# EAGLE design FreqRef (EAGLE 7.4.0)
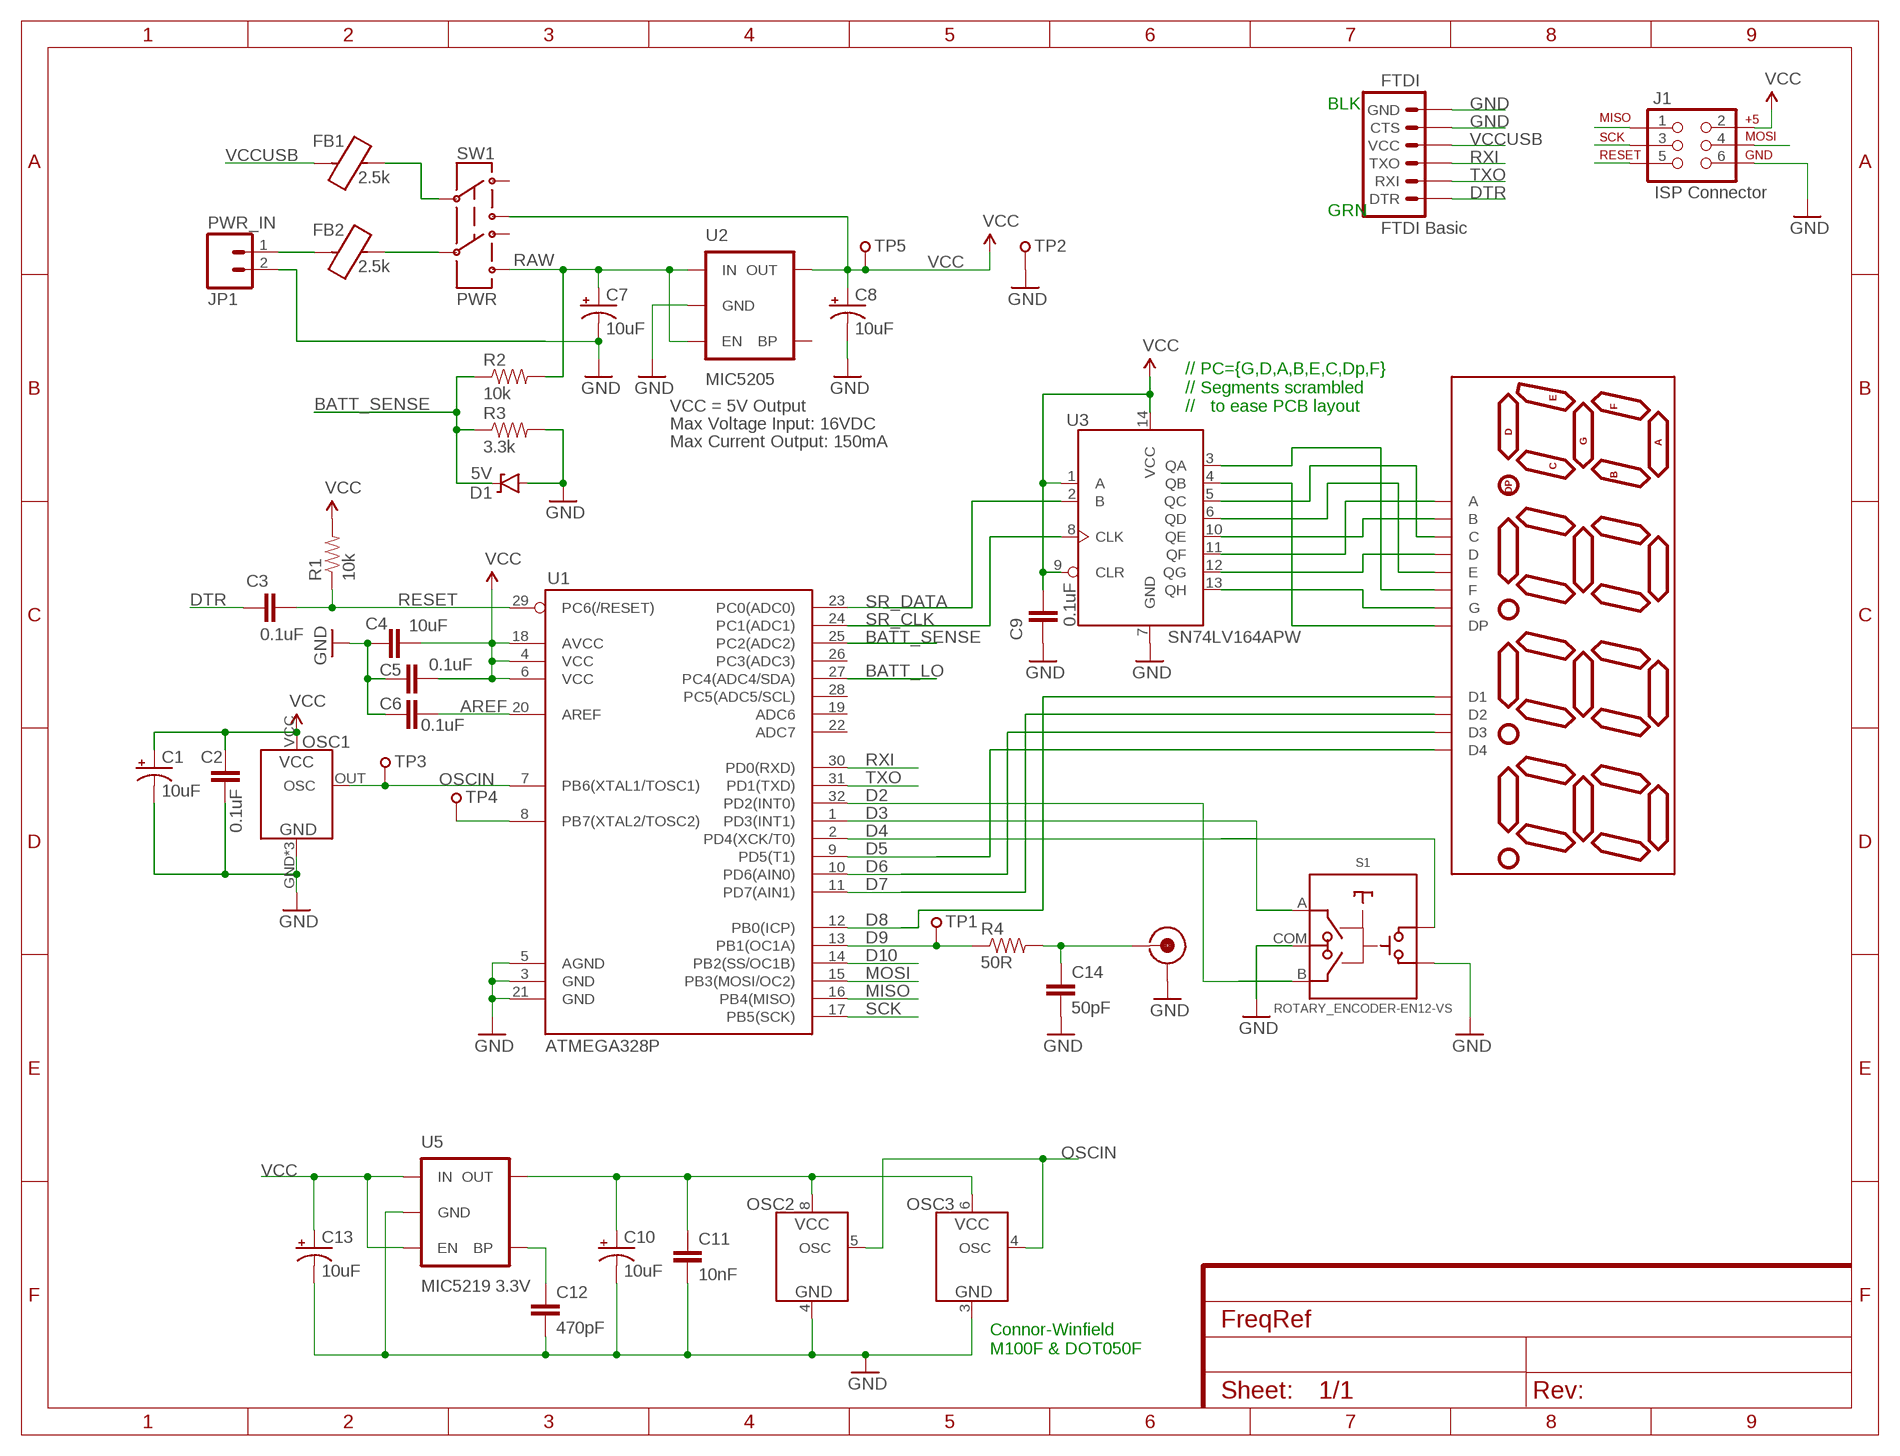
[diagram p0: schematic, sheet 1]

## Parts
C1  10uF  CAP_POL0805  [0805-POL]
C2  0.1uF  CAP0805  [0805]
C3  0.1uF  CAP0805  [0805]
C4  10uF  CAP0805  [0805]
C5  0.1uF  CAP0805  [0805]
C6  0.1uF  CAP0805  [0805]
C7  10uF  CAP_POL0805  [0805-POL]
C8  10uF  CAP_POL0805  [0805-POL]
C9  0.1uF  CAP0805  [0805]
C10  10uF  CAP_POL0805  [0805-POL]
C11  10nF  CAP0805  [0805]
C12  470pF  CAP0805  [0805]
C13  10uF  CAP_POL0805  [0805-POL]
C14  50pF  CAP0805  [0805]
D1  5V  DIODE-ZENER3.3V  [SOD-323]
DISP1  HP_DISPLAY  [DIL12]
FB1  2.5k  FERRITE_BEAD_0805  [0805]
FB2  2.5k  FERRITE_BEAD_0805  [0805]
FRAME1  FRAME_LTR_CU_MARK  [FR-LTR-ON-PCB]
FTDI  FTDI Basic  ARDUINO_SERIAL_PROGRAMPTH  [1X06]
J1  ISP Connector  AVR_SPI_PRG_6PTH  [2X3]
J2  BNC_RIGHT-ANGLE  [BNC-RIGHT-ANGLE]
JP1  PWR_IN  M02POLAR  [MOLEX-1X2]
OSC1  TCXORALTRON  [TCXO]
OSC2  TCXOM100  [TCXO-3.2X5]
OSC3  TCXODOT  [TCXO-9X14]
R1  10k  RESISTOR0805-RES  [0805]
R2  10k  RESISTOR0805-RES  [0805]
R3  3.3k  RESISTOR0805-RES  [0805]
R4  50R  RESISTOR0805-RES  [0805]
S1  ROTARY_ENCODER-EN12-VS  [EN12-VS]
SW1  PWR  SWITCH,BUTTON,ROUND,7MM  [8X10_BUTTON_ROUND]
TP1  TEST_POINT  [BBD-VIA]
TP2  TEST_POINT  [BBD-VIA]
TP3  TEST_POINT  [BBD-VIA]
TP4  TEST_POINT  [BBD-VIA]
TP5  TEST_POINT  [BBD-VIA]
U1  ATMEGA328P  ATMEGA168  [TQFP32-08]
U2  MIC5205  V_REG_LDOSMD  [SOT23-5]
U3  SN74LV164APW  [TSSOP-14(TI)]
U5  MIC5219 3.3V  V_REG_MIC52193.3V  [SOT23-5]

## Nets
AREF: C6.2 U1.20(AREF)
BATT_LO: U1.27(PC4(ADC4/SDA))
BATT_SENSE: D1.C R2.1 R3.1 U1.25(PC2(ADC2))
D2: S1.B U1.32(PD2(INT0))
D3: S1.A U1.1(PD3(INT1))
D4: S1.D U1.2(PD4(XCK/T0))
D5: DISP1.6(D4) U1.9(PD5(T1))
D6: DISP1.4(D3) U1.10(PD6(AIN0))
D7: DISP1.10(D2) U1.11(PD7(AIN1))
D8: DISP1.1(D1) U1.12(PB0(ICP))
D9: R4.1 TP1.P$1 U1.13(PB1(OC1A))
D10: U1.14(PB2(SS/OC1B))
DTR: C3.1 FTDI.1(DTR)
GND [vcc]: C1.2(-) C2.1 C4.1 C5.1 C6.1 C7.2(-) C8.2(-) C9.1 C10.2(-) C11.2 C12.2 C13.2(-) C14.2 D1.A FTDI.5(CTS) FTDI.6(GND) J1.6 J2.SHD JP1.2 OSC1.GND OSC1.SHLD1(GND) OSC1.SHLD2(GND) OSC2.4(GND) OSC3.3(GND) R3.2 S1.COM S1.E TP2.P$1 U1.3(GND) U1.5(AGND) U1.21(GND) U2.2(GND) U3.7(GND) U5.2(GND)
MISO: J1.1 U1.16(PB4(MISO))
MOSI: J1.4 U1.15(PB3(MOSI/OC2))
N$1: DISP1.12(A) U3.11(QF)
N$2: DISP1.11(B) U3.10(QE)
N$3: DISP1.3(C) U3.5(QC)
N$4: DISP1.8(D) U3.12(QG)
N$6: TP4.P$1 U1.8(PB7(XTAL2/TOSC2))
N$8: DISP1.9(F) U3.3(QA)
N$9: DISP1.7(G) U3.13(QH)
N$10: DISP1.5(DP) U3.4(QB)
N$11: C14.1 J2.CTR R4.2
N$12: DISP1.2(E) U3.6(QD)
N$13: FB2.1 JP1.1
N$14: C10.1(+) C11.1 OSC2.8(VCC) OSC3.6(VCC) U5.5(OUT)
N$15: C12.1 U5.4(BP)
N$32: FB1.2 SW1.1C
OSCIN: OSC1.OUT(OSC) OSC2.5(OSC) OSC3.4(OSC) TP3.P$1 U1.7(PB6(XTAL1/TOSC1))
RAW [vcc]: C7.1(+) R2.2 SW1.2NO U2.1(IN) U2.3(EN)
RESET: C3.2 J1.5 R1.1 U1.29(PC6(/RESET))
RXI: FTDI.3(TXO) U1.30(PD0(RXD))
SCK: J1.3 U1.17(PB5(SCK))
SR_CLK: U1.24(PC1(ADC1)) U3.8(CLK)
SR_DATA: U1.23(PC0(ADC0)) U3.2(B)
TXO: FTDI.2(RXI) U1.31(PD1(TXD))
VCC: C1.1(+) C2.2 C4.2 C5.2 C8.1(+) C9.2 C13.1(+) J1.2 OSC1.VCC R1.2 SW1.1NO TP5.P$1 U1.4(VCC) U1.6(VCC) U1.18(AVCC) U2.5(OUT) U3.1(A) U3.9(CLR) U3.14(VCC) U5.1(IN) U5.3(EN)
VCCUSB: FB1.1 FTDI.4(VCC)
VIN: FB2.2 SW1.2C
Unconnected: SW1.1NC SW1.2NC U1.19(ADC6) U1.22(ADC7) U1.26(PC3(ADC3)) U1.28(PC5(ADC5/SCL)) U2.4(BP)

## Notes on the sheet
- BLK
- GRN
- VCC = 5V Output
- // PC={G,D,A,B,E,C,Dp,F}
  // Segments scrambled
  //   to ease PCB layout
- Max Voltage Input: 16VDC
- Max Current Output: 150mA
- Connor-Winfield
  M100F & DOT050F

## Library data of the parts
C1 C7 C8 C10 C13 = ChipsParts:CAP_POL
C2-C6 C9 C11 C12 C14 = SparkFun-Capacitors:CAP: Capacitor Standard 0603 ceramic capacitor, and 0.1" leaded capacitor.
D1 = SparkFun-DiscreteSemi:DIODE-ZENER: Zener Diode Production Part - 8199 3.4V Zener Voltage; PROD_ID: DIO-11284; VALUE: 3.3V
DISP1 = playground:HP_DISPLAY
FB1 FB2 = ChipsParts:FERRITE_BEAD: Ferrite Bead, value is Resistance@Frequency (typ 100 MHz) Example: Digi-Key #1276-6377-1-ND 2.5k ohm @ 100 MHz
FRAME1 = NewFrame:FRAME_LTR_CU_MARK: This frame is sized for an 8.5x11" page with a 0.25" margin. It also places a name, datecode and revision mark in the bottom copper layer of the PCB.; CNAME: Frequency Reference; CREVISION: Rev-B; DATECODE: 2015; DESIGNER: C.Schnarel
FTDI = SparkFun:ARDUINO_SERIAL_PROGRAM
J1 = SparkFun-Connectors:AVR_SPI_PRG_6: AVR ISP 6 Pin This is the reduced ISP connector for AVR programming. Common on Arduino. This footprint will take up less PCB space and can be used with a 10-pin to 6-pin adapter such as SKU: BOB-08508 **Special note about "TEST_POINT" package. The stop mask is on the top side, so if you want your programming test points to be on the bottom of your board, make sure to place this package on the bottom side of the board. This also ensure that the orientation to program from the bottom side will be correct.
J2 = playground:BNC_RIGHT-ANGLE: TE Connectivity AMP Connectors 1-1337543-0, Digi-Key #A97553-ND
JP1 = SparkFun-Connectors:M02: Standard 2-pin 0.1" header. Use with - straight break away headers ( PRT-00116) - right angle break away headers (PRT-00553) - swiss pins (PRT-00743) - machine pins (PRT-00117) - female headers (PRT-00115) Molex polarized connector foot print use with: PRT-08233 with associated crimp pins and housings. 2.54_SCREWTERM for use with PRT-10571. 3.5mm Screw Terminal footprints for PRT-08084 5mm Screw Terminal footprints for use with PRT-08432
OSC1-OSC3 = playground:TCXO: Available here: http://www.ebay.com/itm/RALTRON-RTX0230LC-20-000MHz-TCXO-Oscillator-NEW-5-PKG-/191356909770
R1-R4 = SparkFun-Resistors:RESISTOR: Resistor Basic schematic elements and footprints for 0603, 1206, and PTH resistors.
S1 = ChipsParts:ROTARY_ENCODER: Rotary Encoder with push-button switch. Bourns PEC-16 right-angle mount. DigiKey # PEC16-2215F-S0024-ND TT Electronics EN12 right-angle mount. Digikey # 987-1198-ND
SW1 = StdBxLibrary_BETA_:SWITCH,BUTTON,ROUND,7MM: BETA! SB0003 - Switch, DPDT, PTH, 200mA, 14V, 7mm ROUND CAP Momentary and Push-on/Push-off with various color caps
TP1-TP5 = ChipsParts:TEST_POINT: Test Point
U1 = SparkFun:ATMEGA168
U2 = SparkFun:V_REG_LDO: Voltage Regulator LDO Standard 150mA LDO voltage regulator in SOT-23 layout. Micrel part MIC5205. BP (by-pass) pin is used to lower output noise with 470pF cap.
U3 = ChipsParts:SN74LV164A: 8-BIT SERIAL-IN PARALLEL-OUT SHIFT REGISTER with clear
U5 = SparkFun-PowerIC:V_REG_MIC5219: V_REG MIC5219 Standard 3.3V and 5V 500mA LDO voltage regulator in SOT-23 layout. Micrel part MIC5219. BP (by-pass) pin is used to lower output noise with 470pF cap, may be left open.; PROD_ID: VREG-09872

## Net classes
1 vcc: width 0.254 mm

## Board
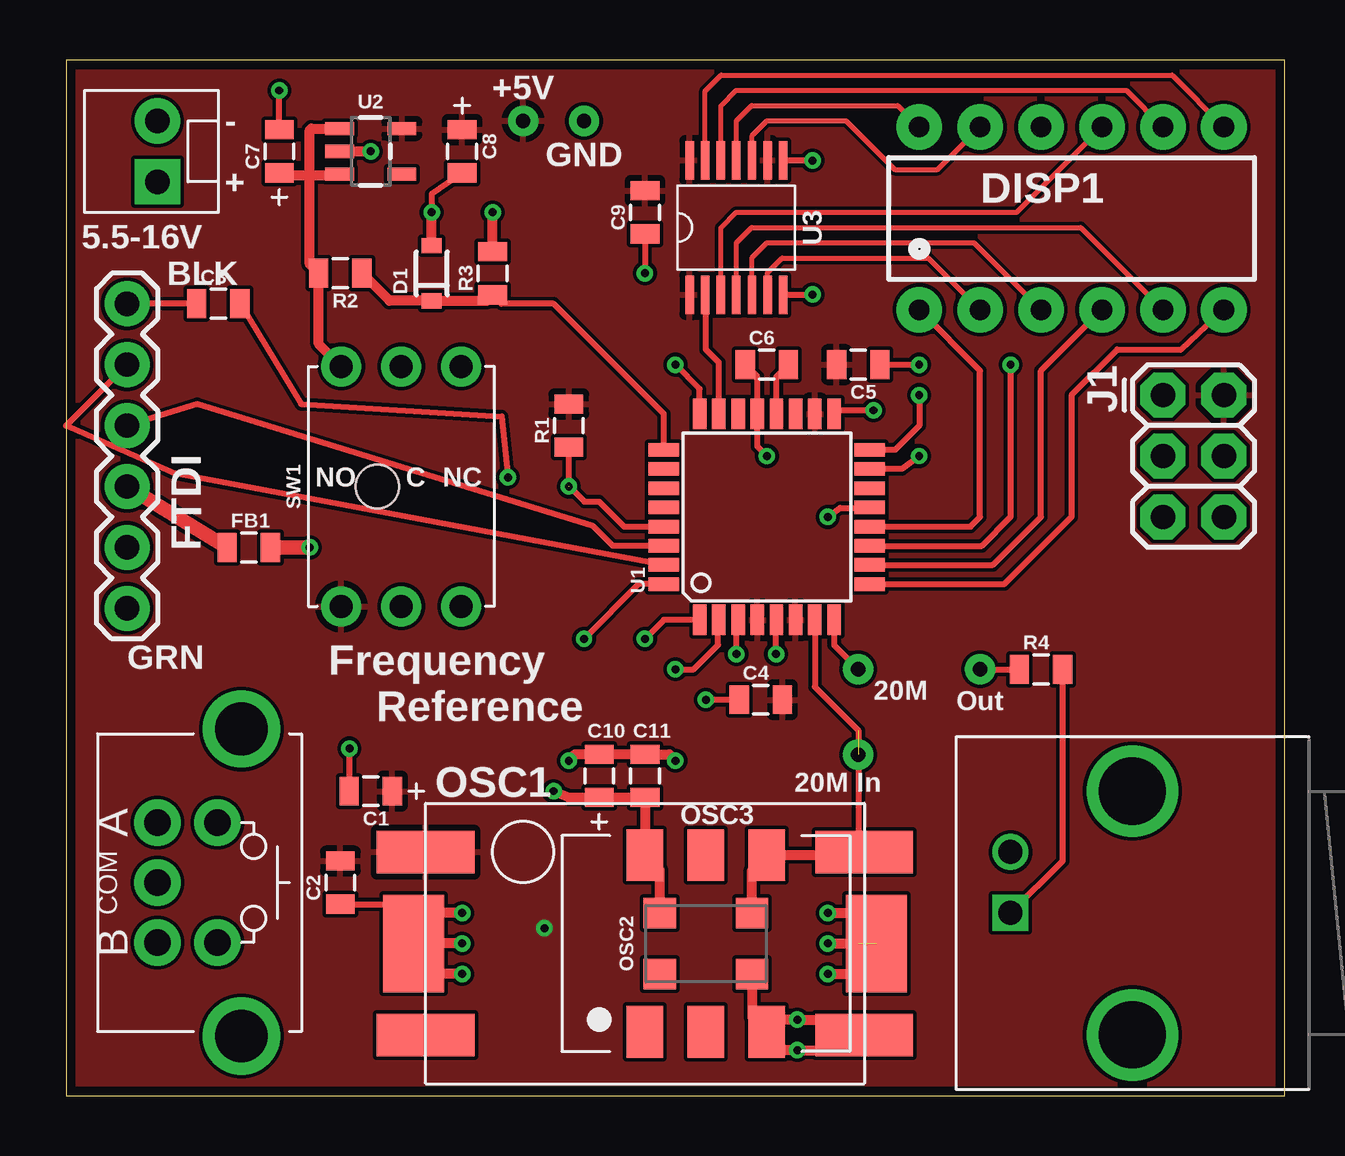
[diagram p1: board, top side]
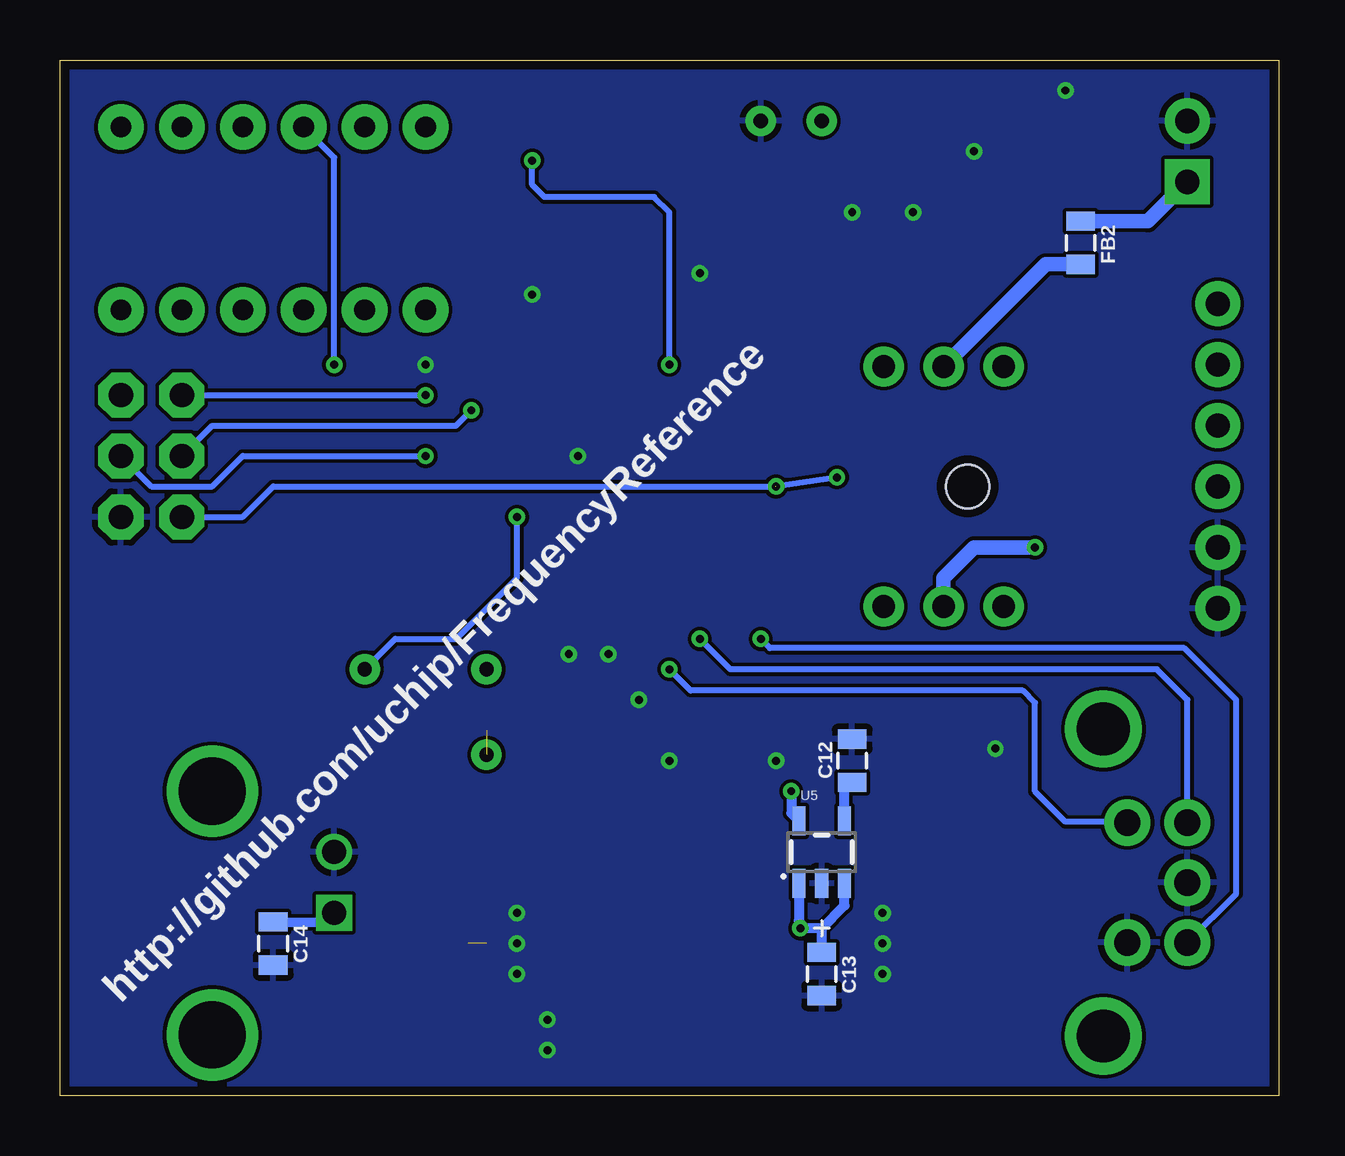
[diagram p2: board, bottom side, seen from below]

Size 50.8 x 43.18 mm. Coordinates in mm from the lower left corner, seen from the top.
Outline: 0,0 50.8,0 50.8,43.18 0,43.18 0,0
Copper layers (1*16): Top 0.0356mm / dielectric 1.5011mm / Bottom 0.0356mm
Design rules "LaenPCBOrder": minimum track width 6mil, minimum drill 13mil, track to track 6mil, track to pad 6mil, pad to pad 6mil, via to via 6mil, smd to smd 6mil, copper to edge 15mil, drill to drill 6mil, minimum pad ring 7mil, minimum via ring 7mil, stop-mask expansion 4mil, vias tented up to drill 0mil, thermal gap 10mil

### Footprints (pad centres in the part's own frame; a part is rotated, then mirrored left to right if it is on the bottom)
0805-POL = smd 0.8 x 1.2: 1 -0.9,0; 2 0.9,0
0805 = smd 0.8 x 1.2: 1 -0.9,0; 2 0.9,0
SOD-323 = smd 0.63 x 0.83: A 1.15,0; C -1.15,0
DIL12 = drill 0.864 pad 1.905: 1 -6.35,-3.81; 2 -3.81,-3.81; 3 -1.27,-3.81; 4 1.27,-3.81; 5 3.81,-3.81; 6 6.35,-3.81; 7 6.35,3.81; 8 3.81,3.81; 9 1.27,3.81; 10 -1.27,3.81; 11 -3.81,3.81; 12 -6.35,3.81
1X06 = drill 1.016 pad 1.88: 1 0,0; 2 2.54,0; 3 5.08,0; 4 7.62,0; 5 10.16,0; 6 12.7,0
2X3 = drill 1.016 pad 1.88 octagon: 1 0,0; 2 0,2.54; 3 2.54,0; 4 2.54,2.54; 5 5.08,0; 6 5.08,2.54
BNC-RIGHT-ANGLE = drill 1 square: CTR 0,-5.08 | drill 2.8: P$3 -5.08,0; P$4 5.08,0 | drill 1: SHD -2.54,-5.08
MOLEX-1X2 = drill 1.016 pad 1.88 square: 1 0,0 | drill 1.016 pad 1.88: 2 2.54,0
TCXO = smd 4.064 x 1.778: GND 9.144,-3.81; NC -9.144,-3.81; OUT 9.144,3.81; VCC -9.144,3.81 | smd 2.54 x 4.064: SHLD1 -9.652,0; SHLD2 9.652,0
TCXO-3.2X5 = smd 1.27 x 1.35: 1 1.27,-1.92; 4 1.27,1.92; 5 -1.27,1.92; 8 -1.27,-1.92
TCXO-9X14 = smd 2.16 x 1.52: 1 3.685,-2.54; 2 3.685,0; 3 3.685,2.54; 4 -3.685,2.54; 5 -3.685,0; 6 -3.685,-2.54
EN12-VS = drill 1.1 pad 1.93: A -2.5,0; B 2.5,0; COM 0,0; D -2.5,2.5; E 2.5,2.5 | drill 2.2: P$6 6.4,3.5; P$7 -6.4,3.5
8X10_BUTTON_ROUND = drill 0.95 pad 1.676: 1C 5,0; 1NC 5,2.5; 1NO 5,-2.5; 2C -5,0; 2NC -5,2.5; 2NO -5,-2.5 | hole 1.8: 0,-1
BBD-VIA = drill 0.6 pad 1.27: P$1 0,0
TQFP32-08 = smd 1.27 x 0.559: 1 -4.293,2.8; 2 -4.293,2; 3 -4.293,1.2; 4 -4.293,0.4; 5 -4.293,-0.4; 6 -4.293,-1.2; 7 -4.293,-2; 8 -4.293,-2.8; 17 4.293,-2.8; 18 4.293,-2; 19 4.293,-1.2; 20 4.293,-0.4; 21 4.293,0.4; 22 4.293,1.2; 23 4.293,2; 24 4.293,2.8 | smd 0.559 x 1.27: 9 -2.8,-4.293; 10 -2,-4.293; 11 -1.2,-4.293; 12 -0.4,-4.293; 13 0.4,-4.293; 14 1.2,-4.293; 15 2,-4.293; 16 2.8,-4.293; 25 2.8,4.293; 26 2,4.293; 27 1.2,4.293; 28 0.4,4.293; 29 -0.4,4.293; 30 -1.2,4.293; 31 -2,4.293; 32 -2.8,4.293
SOT23-5 = smd 0.55 x 1.2: 1 -0.95,-1.3; 2 0,-1.3; 3 0.95,-1.3; 4 0.95,1.3; 5 -0.95,1.3
TSSOP-14(TI) = smd 1.6 x 0.35: 1 -2.8,1.95; 2 -2.8,1.3; 3 -2.8,0.65; 4 -2.8,0; 5 -2.8,-0.65; 6 -2.8,-1.3; 7 -2.8,-1.95; 8 2.8,-1.95; 9 2.8,-1.3; 10 2.8,-0.65; 11 2.8,0; 12 2.8,0.65; 13 2.8,1.3; 14 2.8,1.95

### Placement (x,y rotation side)
C1  12.7,12.7 180 top
C2  11.43,8.89 90 top
C3  6.35,33.02 0 top
C4  28.96,16.51 0 top
C5  33.02,30.48 180 top
C6  29.21,30.48 0 top
C7  8.89,39.37 90 top
C8  16.51,39.37 270 top
C9  24.13,36.83 90 top
C10  22.23,13.34 90 top
C11  24.13,13.34 90 top
C12  17.78,13.97 90 bottom
C13  19.05,5.08 270 bottom
C14  41.91,6.35 270 bottom
D1  15.24,34.29 90 top
DISP1  41.91,36.58 0 top
FB1  7.62,22.86 0 top
FB2  8.26,35.56 270 bottom
FRAME1  49.53,17.78 0 top
FTDI  2.54,33.02 270 top
J1  45.72,29.21 270 top
J2  44.45,7.62 270 top
JP1  3.81,38.1 90 top
OSC1  24.13,6.35 0 top
OSC2  26.67,6.35 270 top
OSC3  26.67,6.35 270 top
R1  20.95,27.94 90 top
R2  11.43,34.29 180 top
R3  17.78,34.29 90 top
R4  40.64,17.78 0 top
S1  3.81,8.89 270 top
SW1  13.97,25.4 270 top
TP1  38.1,17.78 0 top
TP2  21.59,40.64 0 top
TP3  33.02,14.22 0 top
TP4  33.02,17.78 0 top
TP5  19.05,40.64 0 top
U1  29.21,24.13 90 top
U2  12.7,39.37 270 top
U3  27.94,36.2 90 top
U5  19.05,10.16 0 bottom

### Tracks (layer width: path | path; a pad name or v marks a point on that pad's centre or on a via)
AREF
  Top 0.254: U1.20 29.61,29.98 C6.2
BATT_SENSE
  Top 0.254: R3.1 18.15,33.02 20.32,33.02 24.92,28.42 U1.25
  Top 0.406: R2.1 13.48,33.14 D1.C 17.53,33.14 R3.1
D2  (via drill 0.33)
  Top 0.254: U1.32 23.87,21.33 v21.59,19.05
  Bottom 0.254: S1.B 1.78,8.42 1.78,16.51 3.94,18.67 21.21,18.67 v21.59,19.05
D3  (via drill 0.33)
  Top 0.254: U1.1 24.92,19.84 v24.13,19.05
  Bottom 0.254: S1.A 3.81,16.51 5.08,17.78 22.86,17.78 v24.13,19.05
D4  (via drill 0.33)
  Top 0.254: v25.4,17.78 26.16,17.78 27.18,18.8 27.18,19.8 U1.2
  Bottom 0.254: S1.D 6.35,11.43 8.89,11.43 10.16,12.7 10.16,16.38 10.67,16.89 24.51,16.89 v25.4,17.78
D5
  Top 0.254: U1.9 39.11,21.33 41.91,24.13 41.91,29.21 43.81,31.11 46.48,31.11 DISP1.6
D6
  Top 0.254: U1.10 38.64,22.13 40.64,24.13 40.64,30.23 DISP1.4
D7  (via drill 0.33)
  Top 0.254: v39.37,30.48 39.37,24.13 38.17,22.93 U1.11
  Bottom 0.254: v39.37,30.48 39.37,39.12 DISP1.10
D8
  Top 0.254: U1.12 37.7,23.73 38.1,24.13 38.1,30.23 DISP1.1
D9  (via drill 0.33)
  Top 0.254: v31.75,24.13 32.26,24.51 33.52,24.51 U1.13 | TP1.P$1 R4.1
  Bottom 0.254: TP1.P$1 36.83,19.05 34.29,19.05 31.75,21.59 v31.75,24.13
DTR
  Top 0.254: C3.1 FTDI.1
GND  (via drill 0.33)  (1 unrouted)
  Top 0.254: v29.59,18.41 29.59,19.82 U1.5 | v27.94,18.41 27.94,19.77 U1.3 | C4.1 v26.67,16.51 | C6.1 28.81,29.98 U1.21 28.81,27.07 v29.21,26.67 | U3.7 30.98,33.4 v31.11,33.4 | C5.1 v35.56,30.48 | C9.1 v24.13,34.29 | C8.2 15.24,37.59 v15.24,36.83 | C7.2 v8.89,41.91 | C2.1 13.6,7.99 13.97,7.62 13.97,6.86 15.13,7.76 OSC1.SHLD1 | C1.2 11.81,12.71 v11.81,14.48
  Top 0.406: U2.2 v12.7,39.37 | D1.A v15.24,36.83 | R3.2 v17.78,36.83 | v16.51,6.35 15.24,6.35 | v16.51,7.62 15.13,7.62 15.13,7.76 | v16.51,5.08 15.24,5.08 | v31.75,7.62 33.02,7.62 | v31.75,6.35 33.02,6.35 | v31.75,5.08 33.02,5.08 | 31.75,2.54 31.75,1.91 v30.48,1.91 29.21,1.91 29.21,2.54 | 31.75,2.54 31.75,3.17 v30.48,3.17 29.21,3.17 OSC3.3 28.59,3.29 OSC2.4 | 31.75,2.54 OSC1.GND | v25.4,13.97 25.14,14.23 C11.2 C10.2 21.22,14.23 v20.95,13.97
  pour Bottom: 0,0 0,43.18 50.8,43.18 50.8,0
MISO  (via drill 0.33)
  Top 0.254: v35.56,29.21 35.56,27.94 34.55,26.93 U1.16
  Bottom 0.254: J1.1 v35.56,29.21
MOSI  (via drill 0.33)
  Top 0.254: v35.56,26.67 34.83,26.13 U1.15
  Bottom 0.254: J1.4 46.99,25.4 44.45,25.4 43.18,26.67 v35.56,26.67
N$1
  Top 0.203: U3.11 27.94,40.64 28.57,41.27 34.67,41.27 DISP1.12
N$2
  Top 0.203: U3.10 28.59,40.02 29.21,40.64 32.51,40.64 34.54,38.61 36.32,38.61 DISP1.11
N$3
  Top 0.203: U3.5 28.59,34.94 29.21,35.56 37.85,35.56 DISP1.3
N$4
  Top 0.203: U3.12 27.29,41.26 27.94,41.91 44.2,41.91 DISP1.8
N$6
  Top 0.254: U1.8 32.01,18.79 TP4.P$1
N$8
  Top 0.203: U3.3 27.29,36.18 27.94,36.83 39.62,36.83 DISP1.9
N$9
  Top 0.203: U3.13 26.64,41.88 27.3,42.55 46.1,42.55 DISP1.7
N$10
  Top 0.203: U3.4 27.94,35.56 28.57,36.2 42.29,36.2 DISP1.5
N$11
  Top 0.254: J2.CTR 41.54,9.79 R4.2
  Bottom 0.406: C14.1 39.87,7.23 J2.CTR
N$12
  Top 0.203: U3.6 29.24,34.32 29.84,34.92 35.94,34.92 DISP1.2
N$13
  Bottom 0.61: JP1.1 5.45,36.46 FB2.1
N$14  (via drill 0.33)
  Top 0.406: OSC2.8 24.75,9.41 OSC3.6 C11.1 C10.1 20.94,12.44 v20.32,12.7
  Bottom 0.406: v20.32,12.7 20.32,11.78 U5.5
N$15
  Bottom 0.406: U5.4 18.1,12.75 C12.1
N$32  (via drill 0.33)
  Top 0.61: FB1.2 v10.16,22.86
  Bottom 0.61: v10.16,22.86 12.7,22.86 13.97,21.59 SW1.1C
OSCIN  (1 unrouted)
  Top 0.254: U1.7 31.21,17.05 33.02,15.24 33.02,10.41 OSC1.OUT
  Top 0.406: OSC1.OUT 33.27,10.04 OSC3.4 28.59,9.41 OSC2.5
RAW
  Top 0.406: SW1.2NO 10.53,31.34 R2.2 10.16,34.66 10.16,38.35 | 10.16,38.35 10.16,40.26 10.22,40.32 U2.1 | U2.3 11.33,38.35 10.16,38.35 | 10.16,38.35 9.01,38.35 C7.1
RESET  (via drill 0.33)  (1 unrouted)
  Top 0.254: R1.1 20.95,25.41 21.6,24.77 22.23,24.77 23.26,23.73 U1.29 | C3.2 9.79,28.84 18.16,28.32 v18.41,25.78
  Bottom 0.254: J1.5 43.18,24.13 41.91,25.4 v20.95,25.4 v18.41,25.78
RXI
  Top 0.254: U1.30 22.79,22.93 21.97,23.75 5.46,28.83 FTDI.3
SCK  (via drill 0.33)
  Top 0.254: v33.66,28.57 32.13,28.57 32.13,28.54 U1.17
  Bottom 0.254: J1.3 44.45,27.94 34.29,27.94 v33.66,28.57
SR_CLK  (via drill 0.33)
  Top 0.254: U1.24 26.41,29.47 v25.4,30.48 | v31.11,38.99 U3.8
  Bottom 0.254: v25.4,30.48 25.4,36.83 26.04,37.47 30.61,37.47 31.11,37.97 v31.11,38.99
SR_DATA
  Top 0.254: U1.23 27.21,30.57 26.67,31.11 26.67,33.37 U3.2
TXO
  Top 0.254: U1.31 4.54,25.94 0,27.94 FTDI.2
VCC  (via drill 0.33)
  Bottom 0.406: U5.1 20,7.3 v19.94,6.99 19.05,6.99 | 19.05,6.99 18.1,7.93 U5.3 | C13.1 19.05,6.99
  pour Top: 0,0 0,43.18 50.8,43.18 50.8,0
VCCUSB
  Top 0.61: FTDI.4 FB1.1
VIN
  Bottom 0.61: SW1.2C 9.71,34.66 FB2.2

### Text on the board
tPlace: +5V | - | GND | + | 5.5-16V | BLK | GRN | 20M | Out | Frequency / Reference | 20M In
bPlace: http://github.com/uchip/FrequencyReference